# EAGLE design speedometer (EAGLE 9.6.2)
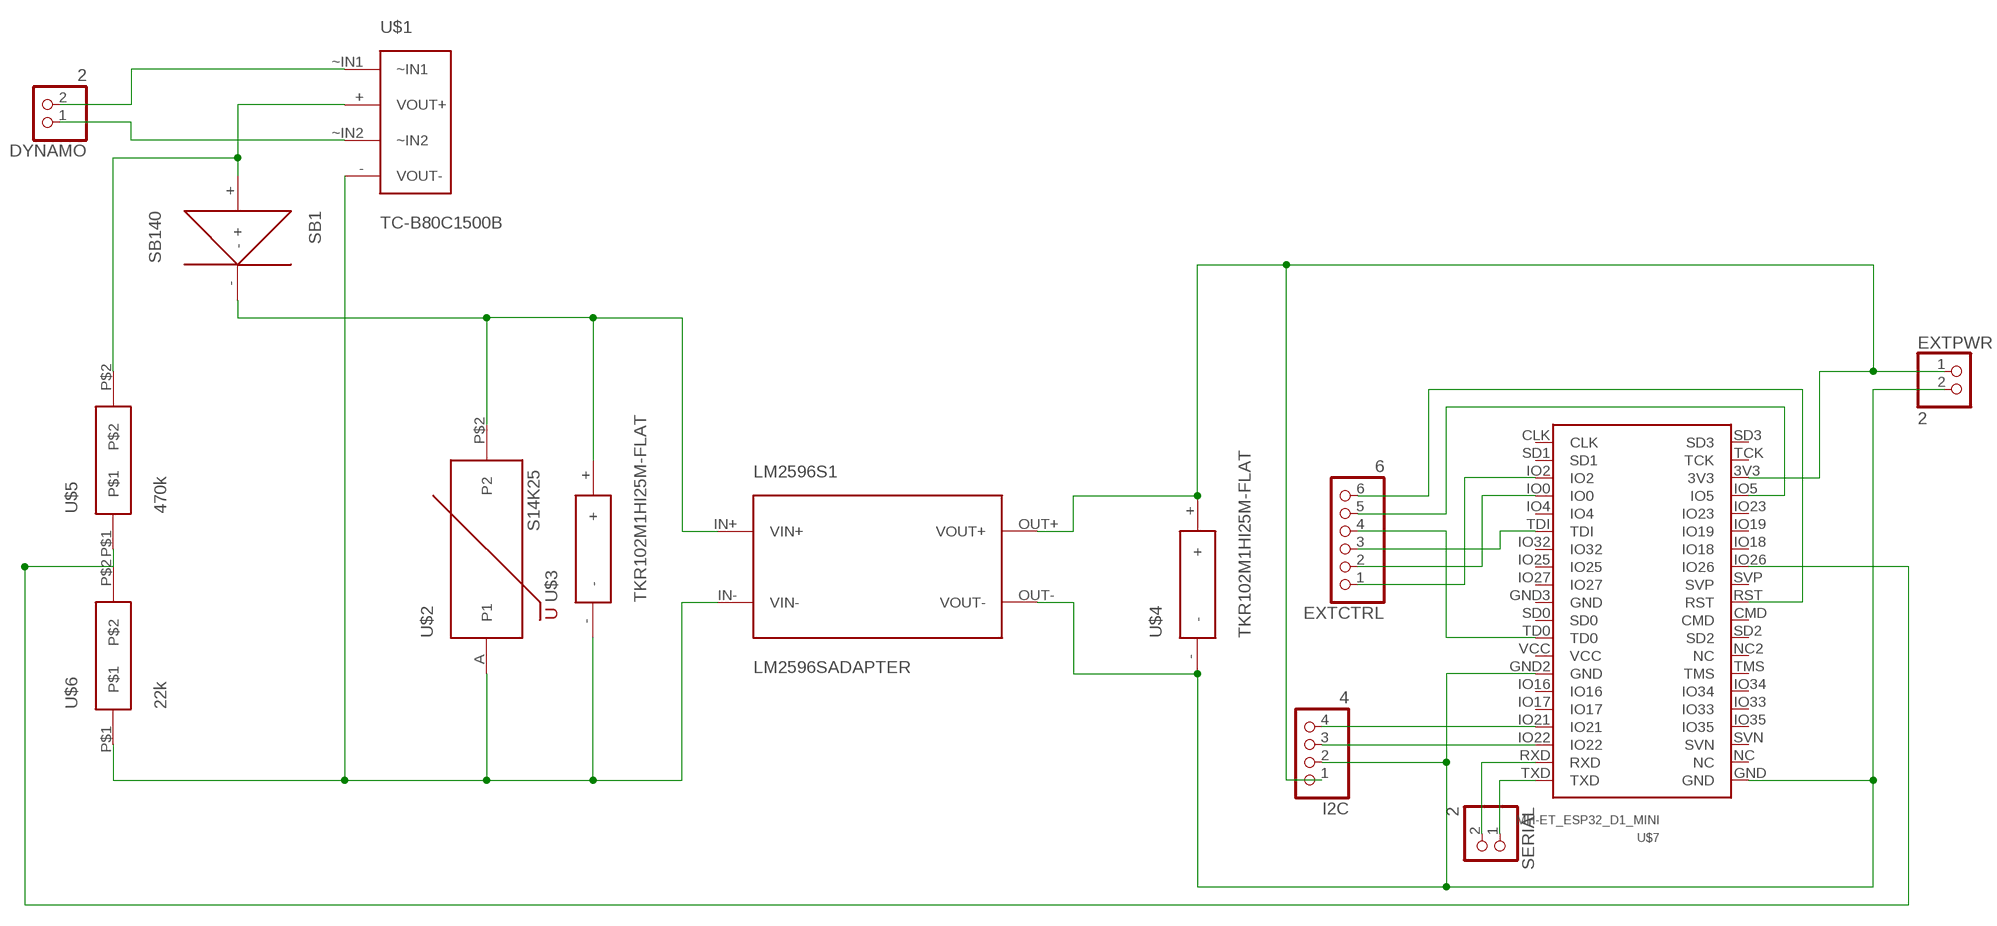
[diagram p0: schematic, sheet 1]

## Parts
DYNAMO  2  PINHD-1X2  [1X02]
EXTCTRL  6  PINHD-1X6  [1X06]
EXTPWR  2  PINHD-1X2  [1X02]
I2C  4  PINHD-1X4  [1X04]
LM2596S1  LM2596SADAPTER  [LM2596SADAPTER]
SB1  SB140  [SB140]
SERIAL  2  PINHD-1X2  [1X02]
U$1  TC-B80C1500B  [TC-B80C1500B]
U$2  S14K25  [S14K25]
U$3  TKR102M1HI25M-FLAT  [TKR102M1HI25M-FLAT]
U$4  TKR102M1HI25M-FLAT  [TKR102M1HI25M-FLAT]
U$5  470k  RESISTOR  [RESISTOR]
U$6  22k  RESISTOR  [RESISTOR]
U$7  MH-ET_ESP32_D1_MINI  [MH-ET_ESP32_D1_MINI]

## Nets
N$1: DYNAMO.2 U$1.~IN1
N$2: DYNAMO.1 U$1.~IN2
N$3: SB1.+ U$1.+(VOUT+) U$5.P$2
N$4: LM2596S1.IN+(VIN+) SB1.- U$2.P$2(P2) U$3.+
N$5: LM2596S1.IN-(VIN-) U$1.-(VOUT-) U$2.A(P1) U$3.- U$6.P$1
N$6: EXTPWR.2 I2C.2 LM2596S1.OUT-(VOUT-) U$4.- U$7.GND U$7.GND2(GND)
N$7: EXTPWR.1 I2C.1 LM2596S1.OUT+(VOUT+) U$4.+ U$7.3V3
N$8: U$5.P$1 U$6.P$2 U$7.IO26
N$9: SERIAL.2 U$7.RXD
N$10: SERIAL.1 U$7.TXD
N$11: I2C.4 U$7.IO21
N$12: I2C.3 U$7.IO22
N$13: EXTCTRL.1 U$7.IO2
N$14: EXTCTRL.2 U$7.IO0
N$15: EXTCTRL.3 U$7.TDI
N$16: EXTCTRL.4 U$7.TD0
N$18: EXTCTRL.5 U$7.IO5
N$19: EXTCTRL.6 U$7.RST
Unconnected: U$7.CLK U$7.CMD U$7.GND3(GND) U$7.IO4 U$7.IO16 U$7.IO17 U$7.IO18 U$7.IO19 U$7.IO23 U$7.IO25 U$7.IO27 U$7.IO32 U$7.IO33 U$7.IO34 U$7.IO35 U$7.NC U$7.NC2(NC) U$7.SD0 U$7.SD1 U$7.SD2 U$7.SD3 U$7.SVN U$7.SVP U$7.TCK U$7.TMS U$7.VCC

## Library data of the parts
DYNAMO EXTPWR SERIAL = pinhead:PINHD-1X2: PIN HEADER
EXTCTRL = pinhead:PINHD-1X6: PIN HEADER
I2C = pinhead:PINHD-1X4: PIN HEADER
LM2596S1 = speedometer:LM2596SADAPTER
SB1 = speedometer:SB140
U$1 = speedometer:TC-B80C1500B
U$2 = speedometer:S14K25
U$3 U$4 = speedometer:TKR102M1HI25M-FLAT
U$5 U$6 = speedometer:RESISTOR
U$7 = MH-ET_ESP32_D1_MINI:MH-ET_ESP32_D1_MINI

## Board
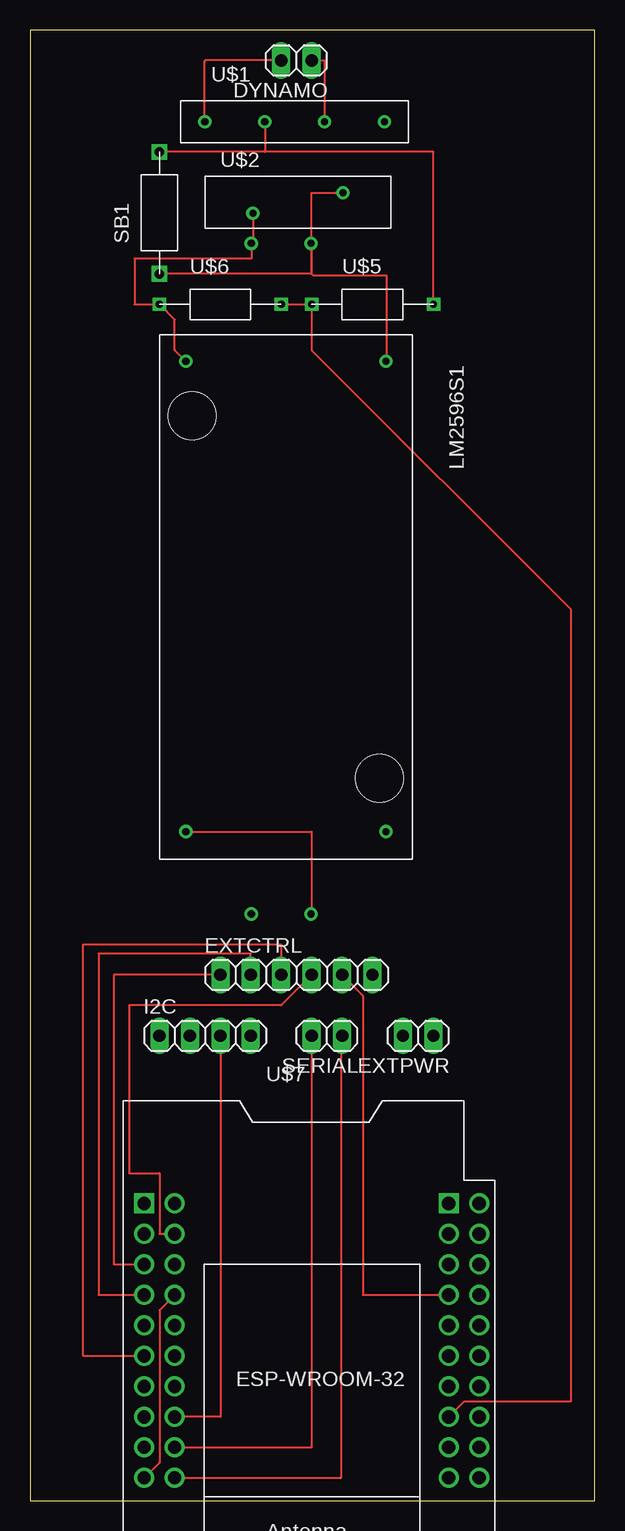
[diagram p1: board, top side]
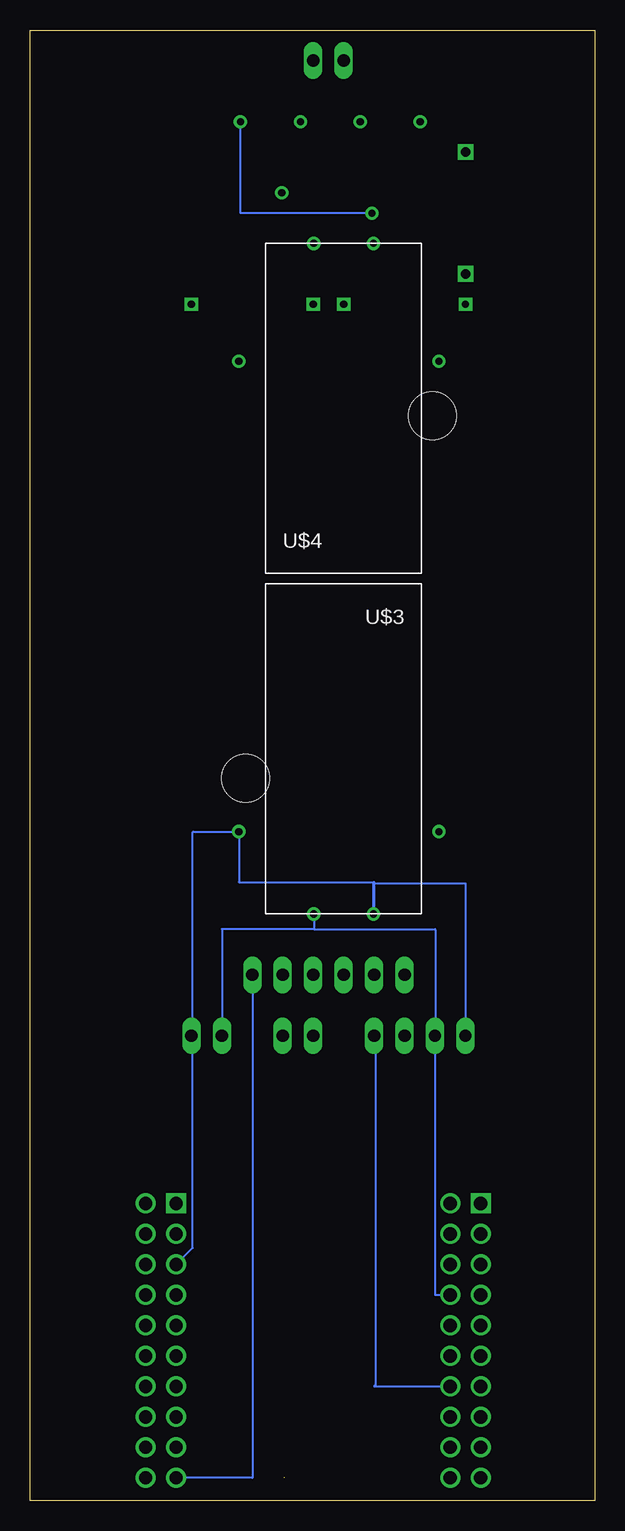
[diagram p2: board, bottom side, seen from below]

Size 47.12 x 122.56 mm. Coordinates in mm from the lower left corner, seen from the top.
Outline: 0,0 47.12,0 47.12,122.56 0,122.56 0,0
Copper layers (1+2*15+16): Top 0.035mm / dielectric 1.5mm / layer 2 0.035mm / dielectric 0.15mm / layer 15 0.035mm / dielectric 0.2mm / Bottom 0.035mm
Design rules "default *": minimum track width 6mil, minimum drill 0.35mm, track to track 6mil, track to pad 6mil, pad to pad 6mil, via to via 6mil, smd to smd 6mil, copper to edge 40mil, drill to drill 6mil, minimum pad ring 10mil, minimum via ring 8mil, stop-mask expansion 4mil, vias tented up to drill 0mil, thermal gap 10mil

### Footprints (pad centres in the part's own frame; a part is rotated, then mirrored left to right if it is on the bottom)
1X02 = drill 1.016 long: 1 -1.27,0; 2 1.27,0
1X06 = drill 1.016 long: 1 -6.35,0; 2 -3.81,0; 3 -1.27,0; 4 1.27,0; 5 3.81,0; 6 6.35,0
1X04 = drill 1.016 long: 1 -3.81,0; 2 -1.27,0; 3 1.27,0; 4 3.81,0
LM2596SADAPTER = drill 0.6 pad 0.991: IN+ 2.21,18.898; IN- 2.21,2.21; OUT+ 41.402,18.898; OUT- 41.402,2.21 | hole 3.988: 36.957,18.339; 6.756,2.743
SB140 = drill 0.8 square: + 5.08,0; - -5.08,0
TC-B80C1500B = drill 0.6 pad 0.864: + 7.01,1.753; - 16.993,1.753; ~IN1 2.007,1.753; ~IN2 11.989,1.753
S14K25 = drill 0.6 pad 0.762: A 3.988,1.245; P$2 11.506,2.946
TKR102M1HI25M-FLAT = drill 0.6 pad 0.559: + 2.489,0; - -2.489,0
RESISTOR = drill 0.6 square: P$1 -5.08,0; P$2 5.08,0
MH-ET_ESP32_D1_MINI = drill 1.11 pad 1.665: 3V3 25.4,-5.08; CMD 27.94,0; GND 0,-22.86; GND2 2.54,-7.62; GND3 27.94,-22.86; IO0 0,-7.62; IO2 0,-5.08; IO4 0,-10.16; IO5 25.4,-7.62; IO16 2.54,-10.16; IO17 2.54,-12.7; IO18 25.4,-15.24; IO19 25.4,-12.7; IO21 2.54,-15.24; IO22 2.54,-17.78; IO23 25.4,-10.16; IO25 0,-17.78; IO26 25.4,-17.78; IO27 0,-20.32; IO32 0,-15.24; IO33 27.94,-12.7; IO34 27.94,-10.16; IO35 27.94,-15.24; NC 27.94,-20.32; NC2 27.94,-5.08; RST 25.4,-22.86; RXD 2.54,-20.32; SD0 2.54,0; SD1 0,-2.54; SD2 27.94,-2.54; SVN 27.94,-17.78; SVP 25.4,-20.32; TCK 25.4,-2.54; TD0 2.54,-2.54; TDI 0,-12.7; TMS 27.94,-7.62; TXD 2.54,-22.86; VCC 2.54,-5.08 | drill 1.11 pad 1.665 square: CLK 0,0; SD3 25.4,0

### Placement (x,y rotation side)
DYNAMO  22.23,120.02 180 top
EXTCTRL  22.23,43.81 0 top
EXTPWR  32.38,38.73 180 top
I2C  14.61,38.73 0 top
LM2596S1  10.8,97.16 270 top
SB1  10.8,107.32 90 top
SERIAL  24.77,38.73 180 top
U$1  12.57,113.16 0 top
U$2  14.61,106.05 0 top
U$3  20.95,104.78 180 bottom
U$4  20.95,48.89 0 bottom
U$5  28.58,99.7 0 top
U$6  15.88,99.7 0 top
U$7  9.53,24.77 0 top

### Tracks (layer width: path | path; a pad name or v marks a point on that pad's centre or on a via)
N$1
  Top 0.152: DYNAMO.2 14.61,120.02 14.58,119.99 U$1.~IN1
N$2
  Top 0.152: U$1.~IN2 24.56,120.02 DYNAMO.1
N$3
  Top 0.152: 19.58,112.4 U$1.+ 19.58,112.5 | 19.58,112.4 SB1.+ | U$5.P$2 33.66,112.4 19.58,112.4
N$4
  Top 0.152: U$3.+ 23.5,104.83 23.5,108.99 U$2.P$2 | SB1.- 23.44,102.23 U$3.+ | U$3.+ 23.5,104.72 23.5,102.23 23.62,102.11 29.72,102.11 29.72,94.97 LM2596S1.IN+
N$5  (via drill 0.35)
  Top 0.152: U$1.- v29.59,114.88 | v18.62,107.32 U$2.A 18.59,104.9 U$3.- 18.47,103.51 8.71,103.51 8.71,99.7 U$6.P$1 12.07,98.43 12.07,95.89 LM2596S1.IN-
  Bottom 0.152: v29.59,114.88 29.59,107.32 v18.62,107.32
N$6
  Top 0.152: LM2596S1.OUT- 23.5,55.75 23.5,48.95 U$4.- | U$7.GND2 10.8,15.88 10.8,3.17 U$7.GND
  Bottom 0.152: 31.12,39.04 EXTPWR.2 31.12,47.62 23.44,47.62 | 23.44,47.62 13.34,47.62 13.28,47.57 13.28,38.73 I2C.2 13.34,17.15 U$7.GND2 | U$4.- 23.44,47.62
N$7  (via drill 0.35)
  Top 0.152: v18.41,48.95 U$4.+
  Bottom 0.152: EXTPWR.1 33.55,38.73 | v18.41,48.95 18.41,51.56 18.44,51.54 29.69,51.54 LM2596S1.OUT+ 33.5,55.75 33.55,55.7 33.55,38.73 | U$4.+ 18.47,51.43 10.8,51.43 I2C.1 | U$7.3V3 33.55,21.06 33.55,38.73
N$8
  Top 0.152: U$6.P$2 U$5.P$1 23.5,95.89 45.09,74.3 45.09,8.26 36.2,8.26 U$7.IO26
N$9
  Top 0.152: SERIAL.2 23.5,4.45 U$7.RXD
N$10  (via drill 0.35)  (1 unrouted)
  Top 0.152: v25.93,38.73 25.93,1.91 | U$7.TXD 25.91,1.91
  Bottom 0.152: SERIAL.1 v25.93,38.73
N$11
  Bottom 0.152: I2C.4 18.31,38.73 18.31,9.63 18.41,9.53 U$7.IO21
N$12
  Top 0.152: U$7.IO22 15.88,6.98 I2C.3
N$13
  Top 0.152: EXTCTRL.1 6.99,43.81 6.99,19.69 U$7.IO2
N$14
  Top 0.152: EXTCTRL.2 18.41,45.59 5.72,45.59 5.72,17.15 U$7.IO0
N$15
  Top 0.152: EXTCTRL.3 20.95,46.35 4.45,46.35 4.45,12.06 U$7.TDI
N$16
  Top 0.152: EXTCTRL.4 20.95,41.27 8.26,41.27 8.26,27.31 10.8,27.31 10.8,22.23 U$7.TD0
N$18
  Top 0.152: EXTCTRL.5 27.76,42.09 27.76,17.15 U$7.IO5
N$19
  Bottom 0.152: U$7.RST 28.58,1.91 EXTCTRL.6